# Altium schematic sheet LCD&Camera Connectors.SchDoc: LCD & Camera connectors
size A4; Project: STM32H7-DK; Date: Not used; ApprovedBy: Not used; CheckedBy: Not used; Author: Not used; CompanyName: STMicroelectronics; DrawnBy: Not used; Engineer: Not used; Organization: Not used; Address1: Not used; Address2: Not used; Address3: Not used; Address4: Not used; DocumentNumber: Not used; Revision: Not used; SheetNumber: 7; SheetTotal: 16; CurrentTime: Not used; CurrentDate: Not used; Time: Not used; DocumentFullPathAndName: Not used; DocumentName: Not used; ModifiedDate: Not used; ImagePath: Not used; ProjectName: Not used; Application_BuildNumber: Not used
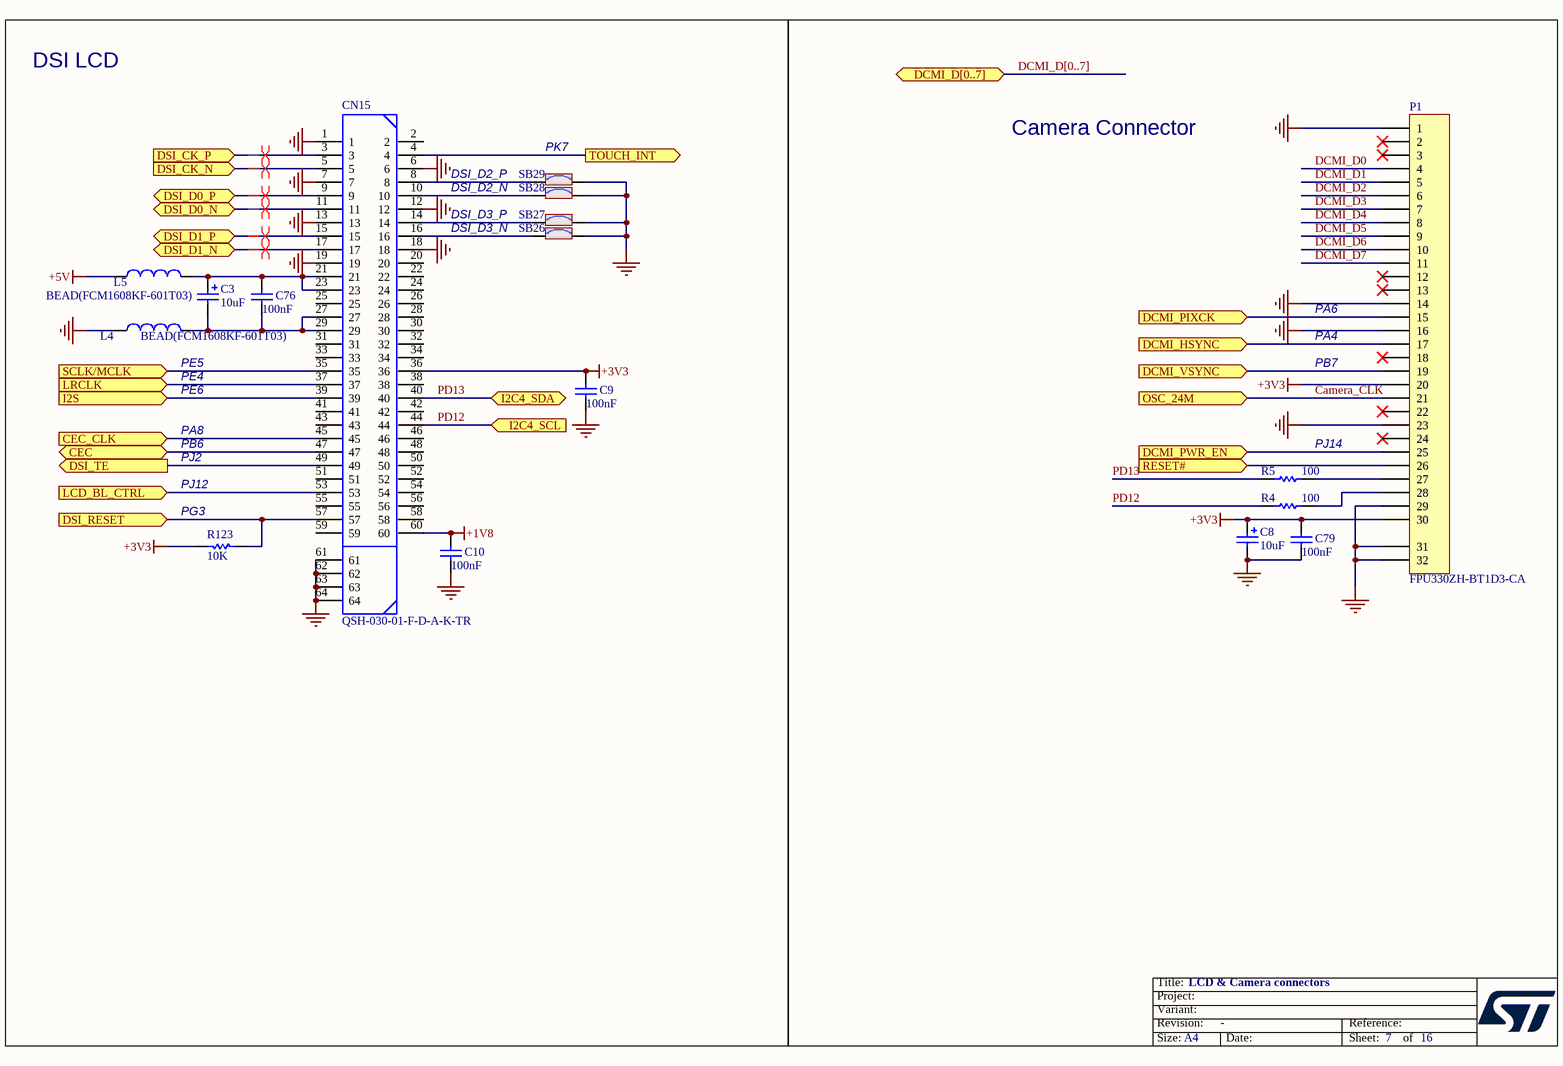
[diagram p0: LCD&Camera Connectors.SchDoc]

## Parts
C3  10uF  [TAN-A]
C8  10uF  [TAN-A]
C9  100nF  [0603C]
C10  100nF  [0603C]
C76  100nF  [0603C]
C79  100nF  [0603C]
CN15  QSH-030-01-F-D-A-K-TR  [QSH-030-01-F-D-A]
L4  BEAD(FCM1608KF-601T03)  [0603L]
L5  BEAD(FCM1608KF-601T03)  [0603L]
P1  FPU330ZH-BT1D3-CA  [FPU330ZH-BT1D3-CA]
R4  100  [0603R]
R5  100  [0603R]
R123  10K  [0603R]
SB26  Solder Bridge ON  [SB_0603]  (value not drawn)
SB27  Solder Bridge ON  [SB_0603]  (value not drawn)
SB28  Solder Bridge ON  [SB_0603]  (value not drawn)
SB29  Solder Bridge ON  [SB_0603]  (value not drawn)

## Ports
CEC (bidir), CEC_CLK (in), DCMI_D[0..7] (bidir), DCMI_HSYNC (in), DCMI_PIXCK (in), DCMI_PWR_EN (in), DCMI_VSYNC (in), DSI_CK_N (in), DSI_CK_P (in), DSI_D0_N (bidir), DSI_D0_P (bidir), DSI_D1_N (bidir), DSI_D1_P (bidir), DSI_RESET (in), DSI_TE (out), I2C4_SCL (in), I2C4_SDA (bidir), I2S (in), LCD_BL_CTRL (in), LRCLK (in), OSC_24M (in), RESET# (in), SCLK/MCLK (in), TOUCH_INT (out)

## Nets
+1V8: C10.1 CN15.60
+3V3: C8.1 C9.1 C79.2 CN15.36 P1.20 P1.30 R123.2
+5V: L5.1
GND: C8.2 C9.2 C10.2 C79.1 CN15.1 CN15.6 CN15.7 CN15.12 CN15.13 CN15.18 CN15.19 CN15.61 CN15.62 CN15.63 CN15.64 L4.1 P1.1 P1.14 P1.16 P1.23 P1.29 P1.31 P1.32 SB26.2 SB27.2 SB28.2 SB29.2
Camera_CLK: P1.21 ; port OSC_24M
CEC: CN15.47 ; port CEC
CEC_CLK: CN15.45 ; port CEC_CLK
DCMI_D0: P1.4
DCMI_D1: P1.5
DCMI_D2: P1.6
DCMI_D3: P1.7
DCMI_D4: P1.8
DCMI_D5: P1.9
DCMI_D6: P1.10
DCMI_D7: P1.11
DCMI_HSYNC: P1.17 ; port DCMI_HSYNC
DCMI_PIXCK: P1.15 ; port DCMI_PIXCK
DCMI_PWR_EN: P1.25 ; port DCMI_PWR_EN
DCMI_VSYNC: P1.19 ; port DCMI_VSYNC
DSI_CK_N: CN15.5 ; port DSI_CK_N
DSI_CK_P: CN15.3 ; port DSI_CK_P
DSI_D0_N: CN15.11 ; port DSI_D0_N
DSI_D0_P: CN15.9 ; port DSI_D0_P
DSI_D1_N: CN15.17 ; port DSI_D1_N
DSI_D1_P: CN15.15 ; port DSI_D1_P
DSI_RESET: CN15.57 R123.1 ; port DSI_RESET
DSI_TE: CN15.49 ; port DSI_TE
I2S: CN15.39 ; port I2S
LCD_BL_CTRL: CN15.53 ; port LCD_BL_CTRL
LRCLK: CN15.37 ; port LRCLK
PD12: CN15.44 R4.1 ; port I2C4_SCL
PD13: CN15.40 R5.1 ; port I2C4_SDA
RESET#: P1.26 ; port RESET#
SCLK/MCLK: CN15.35 ; port SCLK/MCLK
TOUCH_INT: CN15.4 ; port TOUCH_INT
NetC3_1: C3.1 C76.1 CN15.21 CN15.23 L5.2
NetC3_2: C3.2 C76.2 CN15.27 CN15.29 L4.2
NetCN15_8: CN15.8 SB29.1
NetCN15_10: CN15.10 SB28.1
NetCN15_14: CN15.14 SB27.1
NetCN15_16: CN15.16 SB26.1
NetP1_27: P1.27 R5.2
NetP1_28: P1.28 R4.2

Not connected (* = marked no-connect by the designer): CN15 2 20 22 24 25 26 28 30 31 32 33 34 38 41 42 43 46 48 50 51 52 54 55 56 58 59; P1 2* 3* 12* 13* 18* 22* 24*

## Buses and harness runs
bus DCMI_D[0..7] = port DCMI_D[0..7]

## Layout directives
differential pair: DSI_CK_N, DSI_CK_P, DSI_D0_N, DSI_D0_P, DSI_D1_N, DSI_D1_P

## Notes on the sheet
- DSI LCD
- DSI_D2_P
- DSI_D2_N
- PK7
- Camera Connector
- DSI_D3_P
- DSI_D3_N
- PA6
- PE6
- (near L4) PE5
- (near L4) PE4
- PA4
- PB7
- PJ2
- PB6
- PA8
- (near R5) PJ14
- PJ12
- (near R123) PG3
- Title:
- Project:
- Size:
- Revision:
- Variant:
- A4
- -
- Date:
- Reference:
- Sheet:
- of

## Library data of the parts
C3 C8 = Cap_10uF_POL_10%_TANA: Polarized Capacitor,10uF,10V,10%,typeA,VISHAY; Manuf_Part_1: 293D106X9010A2TE3; Revision: July-2002: Re-released for DXP Platform.; Value: 10uF; Manuf_1: VISHAY; Order: *; ECCN_US/EU: n/a
C9 C10 C76 = Cap: Capacitor; Value: 10nF; Published: 8-Jun-2000; Revision: July-2002: Re-released for DXP Platform.; Publisher: Altium Limited
C79 = Cap_100nF_X7R_10%_0402: Capacitor,100nF,16V,X7R,10%,0402,YAGEO; Revision: July-2002: Re-released for DXP Platform.; Value: 100nF; Manuf_1: YAGEO
CN15 = QSH-030-01-F-D-A: HIGH SPEED SOCKET STRIP, .5mm PITCH, 60 PINS; MANUFACTURER: SAMTEC; PCB DECAL: QSH-030-01-X-D-A; CREATED: 28 JAN 2014 - WENDY XIN
L4 L5 = Inductor: Value: 100uH; Published: 8-Jun-2000; Revision: July-2002: Re-released for DXP Platform.; Publisher: Altium Limited
P1 = FPU330ZH-BT1D3-CA: TOWNES -  Connector FFC/FPC ZIF 0.5mm 30 pins, Lower Contacts; Manuf_Part_2: TFP-A330ZH-BT1-ECX; Manuf_Part_1: FPU330ZH-BT1D3-CA; Order: *; Manuf_1: TOWNES; Distrib: Sub Co; ECCN_US/EU: n/a; Manuf_2: TOWNES
R4 R5 = Res_100_1%_0402: Resistor,100,0402,1%,YAGEO; Order: 9239111; Value: 100; Manuf_1: YAGEO; ECCN_US/EU: n/a; Distrib: FARNELL
R123 = Res1: Resistor; Value: 1K; Published: 8-Jun-2000; Revision: July-2002: Re-released for DXP Platform.; Publisher: Altium Limited
SB26-SB29 = SB_ON: Fitted: YES; Ordered by: Subcon; Revision: July-2002: Re-released for DXP Platform.; ECCN_US/EU: n/a